# EAGLE design fami (EAGLE 7.7.0)
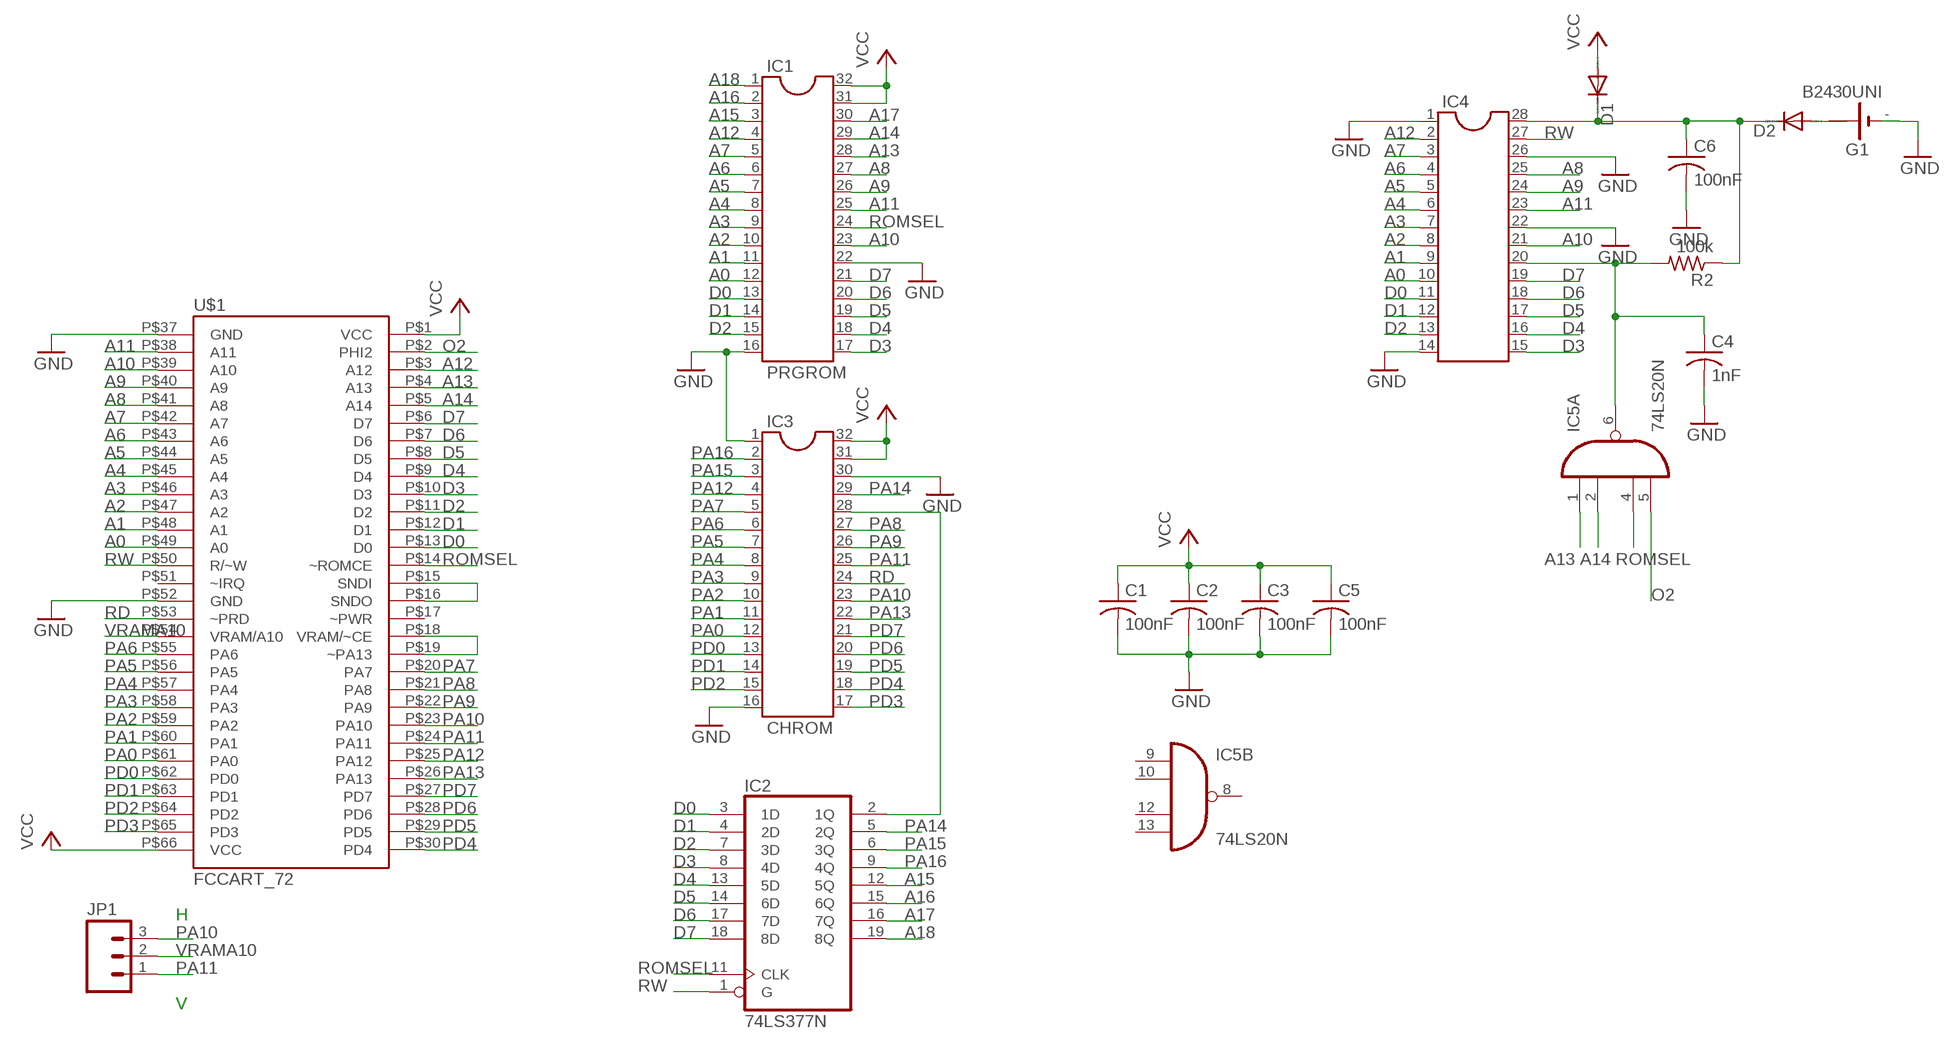
[diagram p0: schematic, sheet 1]

## Parts
C1  100nF  C-US025-025X050  [C025-025X050]
C2  100nF  C-US025-025X050  [C025-025X050]
C3  100nF  C-US025-025X050  [C025-025X050]
C4  1nF  C-US025-025X050  [C025-025X050]
C5  100nF  C-US025-025X050  [C025-025X050]
C6  100nF  C-US025-025X050  [C025-025X050]
D1  DIODE-D-5  [D-5]
D2  DIODE-D-5  [D-5]
G1  B2430UNI  [B2430UNI]
IC1  PRGROM  DIL32  [DIL32]
IC2  74LS377N  [DIL20]
IC3  CHROM  DIL32  [DIL32]
IC4  DIL28  [DIL28-6]
IC5  74LS20N  [DIL14]
JP1  M03PTH  [1X03]
R2  100k  R-US_0204/7  [0204/7]
U$1  FCCART_72  [FCCART_72]

## Nets
A0: IC1.12 IC4.10 U$1.P$49(A0)
A1: IC1.11 IC4.9 U$1.P$48(A1)
A2: IC1.10 IC4.8 U$1.P$47(A2)
A3: IC1.9 IC4.7 U$1.P$46(A3)
A4: IC1.8 IC4.6 U$1.P$45(A4)
A5: IC1.7 IC4.5 U$1.P$44(A5)
A6: IC1.6 IC4.4 U$1.P$43(A6)
A7: IC1.5 IC4.3 U$1.P$42(A7)
A8: IC1.27 IC4.25 U$1.P$41(A8)
A9: IC1.26 IC4.24 U$1.P$40(A9)
A10: IC1.23 IC4.21 U$1.P$39(A10)
A11: IC1.25 IC4.23 U$1.P$38(A11)
A12: IC1.4 IC4.2 U$1.P$3(A12)
A13: IC1.28 IC5.1(A:I0) U$1.P$4(A13)
A14: IC1.29 IC5.2(A:I1) U$1.P$5(A14)
A15: IC1.3 IC2.12(5Q)
A16: IC1.2 IC2.15(6Q)
A17: IC1.30 IC2.16(7Q)
A18: IC1.1 IC2.19(8Q)
D0: IC1.13 IC2.3(1D) IC4.11 U$1.P$13(D0)
D1: IC1.14 IC2.4(2D) IC4.12 U$1.P$12(D1)
D2: IC1.15 IC2.7(3D) IC4.13 U$1.P$11(D2)
D3: IC1.17 IC2.8(4D) IC4.15 U$1.P$10(D3)
D4: IC1.18 IC2.13(5D) IC4.16 U$1.P$9(D4)
D5: IC1.19 IC2.14(6D) IC4.17 U$1.P$8(D5)
D6: IC1.20 IC2.17(7D) IC4.18 U$1.P$7(D6)
D7: IC1.21 IC2.18(8D) IC4.19 U$1.P$6(D7)
GND: C1.2 C2.2 C3.2 C4.2 C5.2 C6.2 G1.- G1.-@1(-) IC1.16 IC1.22 IC3.1 IC3.16 IC3.30 IC4.1 IC4.14 IC4.22 IC4.26 U$1.P$37(GND) U$1.P$52(GND)
N$1: IC2.2(1Q) IC3.28
N$2: U$1.P$15(SNDI) U$1.P$16(SNDO)
N$3: U$1.P$18(VRAM/~CE) U$1.P$19(~PA13)
N$6: C6.1 D1.C D2.C IC4.28 R2.1
N$7: C4.1 IC4.20 IC5.6(A:O) R2.2
N$9: D2.A G1.+@4(+)
O2: IC5.5(A:I3) U$1.P$2(PHI2)
PA0: IC3.12 U$1.P$61(PA0)
PA1: IC3.11 U$1.P$60(PA1)
PA2: IC3.10 U$1.P$59(PA2)
PA3: IC3.9 U$1.P$58(PA3)
PA4: IC3.8 U$1.P$57(PA4)
PA5: IC3.7 U$1.P$56(PA5)
PA6: IC3.6 U$1.P$55(PA6)
PA7: IC3.5 U$1.P$20(PA7)
PA8: IC3.27 U$1.P$21(PA8)
PA9: IC3.26 U$1.P$22(PA9)
PA10: IC3.23 JP1.3 U$1.P$23(PA10)
PA11: IC3.25 JP1.1 U$1.P$24(PA11)
PA12: IC3.4 U$1.P$25(PA12)
PA13: IC3.22 U$1.P$26(PA13)
PA14: IC2.5(2Q) IC3.29
PA15: IC2.6(3Q) IC3.3
PA16: IC2.9(4Q) IC3.2
PD0: IC3.13 U$1.P$62(PD0)
PD1: IC3.14 U$1.P$63(PD1)
PD2: IC3.15 U$1.P$64(PD2)
PD3: IC3.17 U$1.P$65(PD3)
PD4: IC3.18 U$1.P$30(PD4)
PD5: IC3.19 U$1.P$29(PD5)
PD6: IC3.20 U$1.P$28(PD6)
PD7: IC3.21 U$1.P$27(PD7)
RD: IC3.24 U$1.P$53(~PRD)
ROMSEL: IC1.24 IC2.11(CLK) IC5.4(A:I2) U$1.P$14(~ROMCE)
RW: IC2.1(G) IC4.27 U$1.P$50(R/~W)
VCC: C1.1 C2.1 C3.1 C5.1 D1.A IC1.31 IC1.32 IC3.31 IC3.32 U$1.P$1(VCC) U$1.P$66(VCC)
VRAMA10: JP1.2 U$1.P$54(VRAM/A10)
Unconnected: IC5.8(B:O) IC5.9(B:I0) IC5.10(B:I1) IC5.12(B:I2) IC5.13(B:I3) U$1.P$17(~PWR) U$1.P$51(~IRQ)

## Notes on the sheet
- H
- V

## Power pins joined to a net without a drawn wire
GND: IC2.10(GND) IC5.7(P:GND)
VCC: IC2.20(VCC) IC5.14(P:VCC)

## Library data of the parts
C1-C6 = rcl:C-US: CAPACITOR, American symbol
D1 D2 = diode:DIODE-: DIODE
G1 = battery:B2430UNI: LI BATTERY
IC1 IC3 = ic-package:DIL32: Dual In Line
IC2 = 74xx-us:74*377: Octal D type FLIP FLOP, enable
IC4 = ic-package:DIL28: Dual In Line
IC5 = 74xx-eu:74*20: Dual 4-input NAND gate
JP1 = SparkFun-Connectors:M03: Header 3 Standard 3-pin 0.1" header. Use with straight break away headers (SKU : PRT-00116), right angle break away headers (PRT-00553), swiss pins (PRT-00743), machine pins (PRT-00117), and female headers (PRT-00115). Molex polarized connector foot print use with SKU : PRT-08232 with associated crimp pins and housings.
R2 = rcl:R-US_: RESISTOR, American symbol
U$1 = FC_connector_2:FCCART_72

## Board
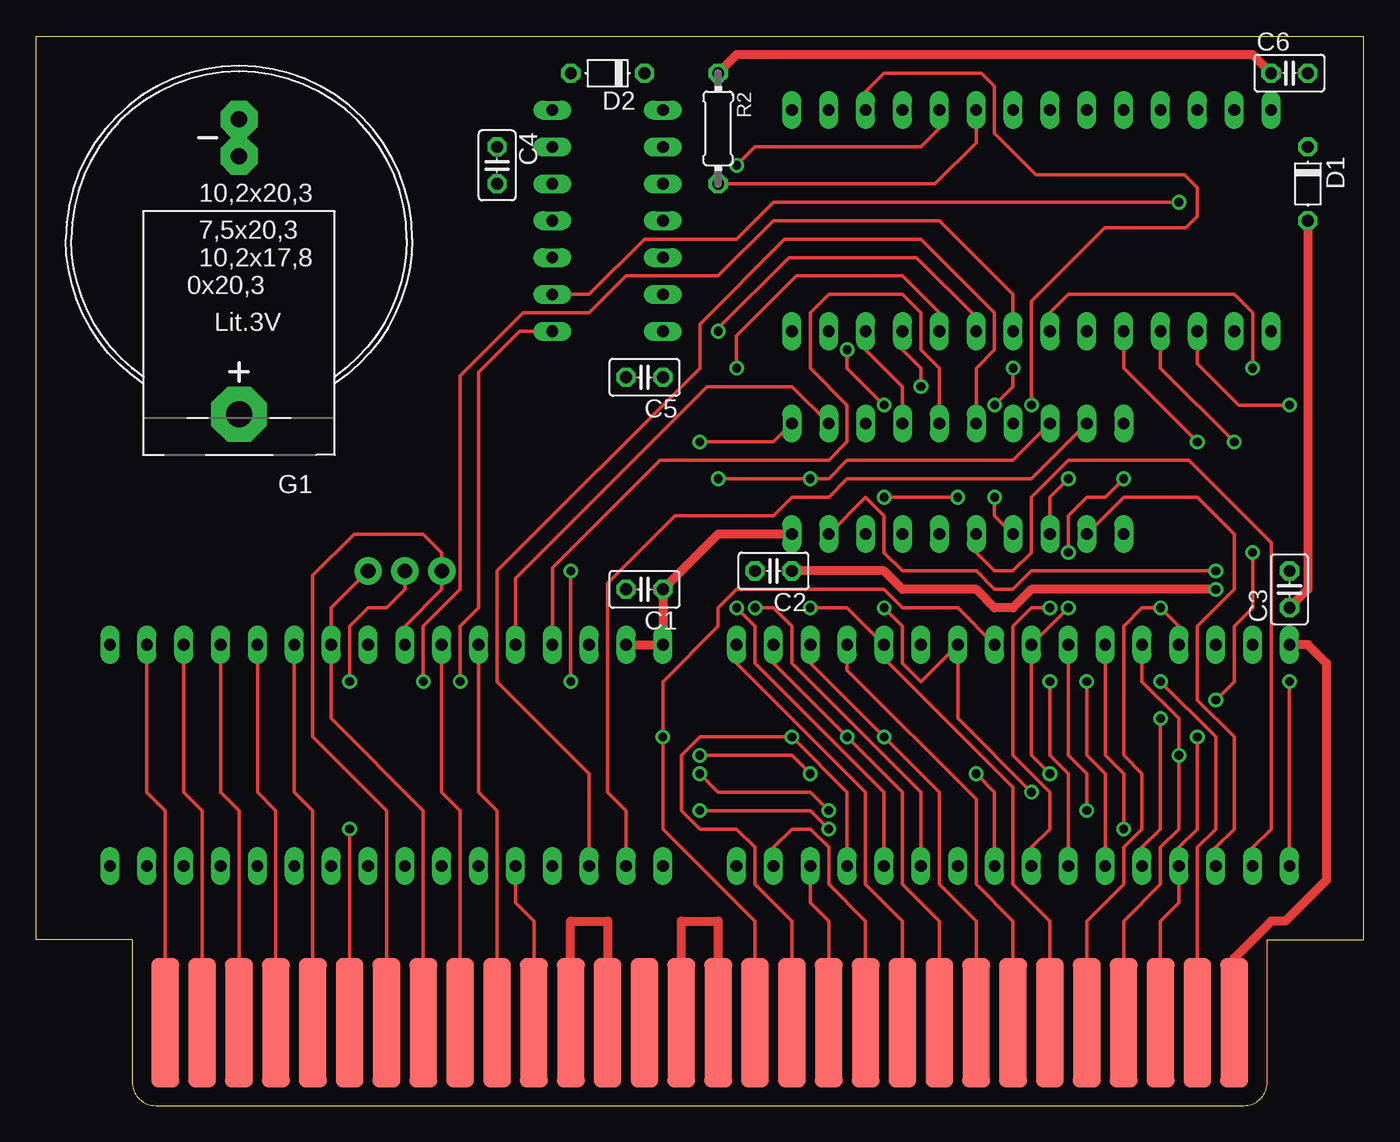
[diagram p1: board, top side]
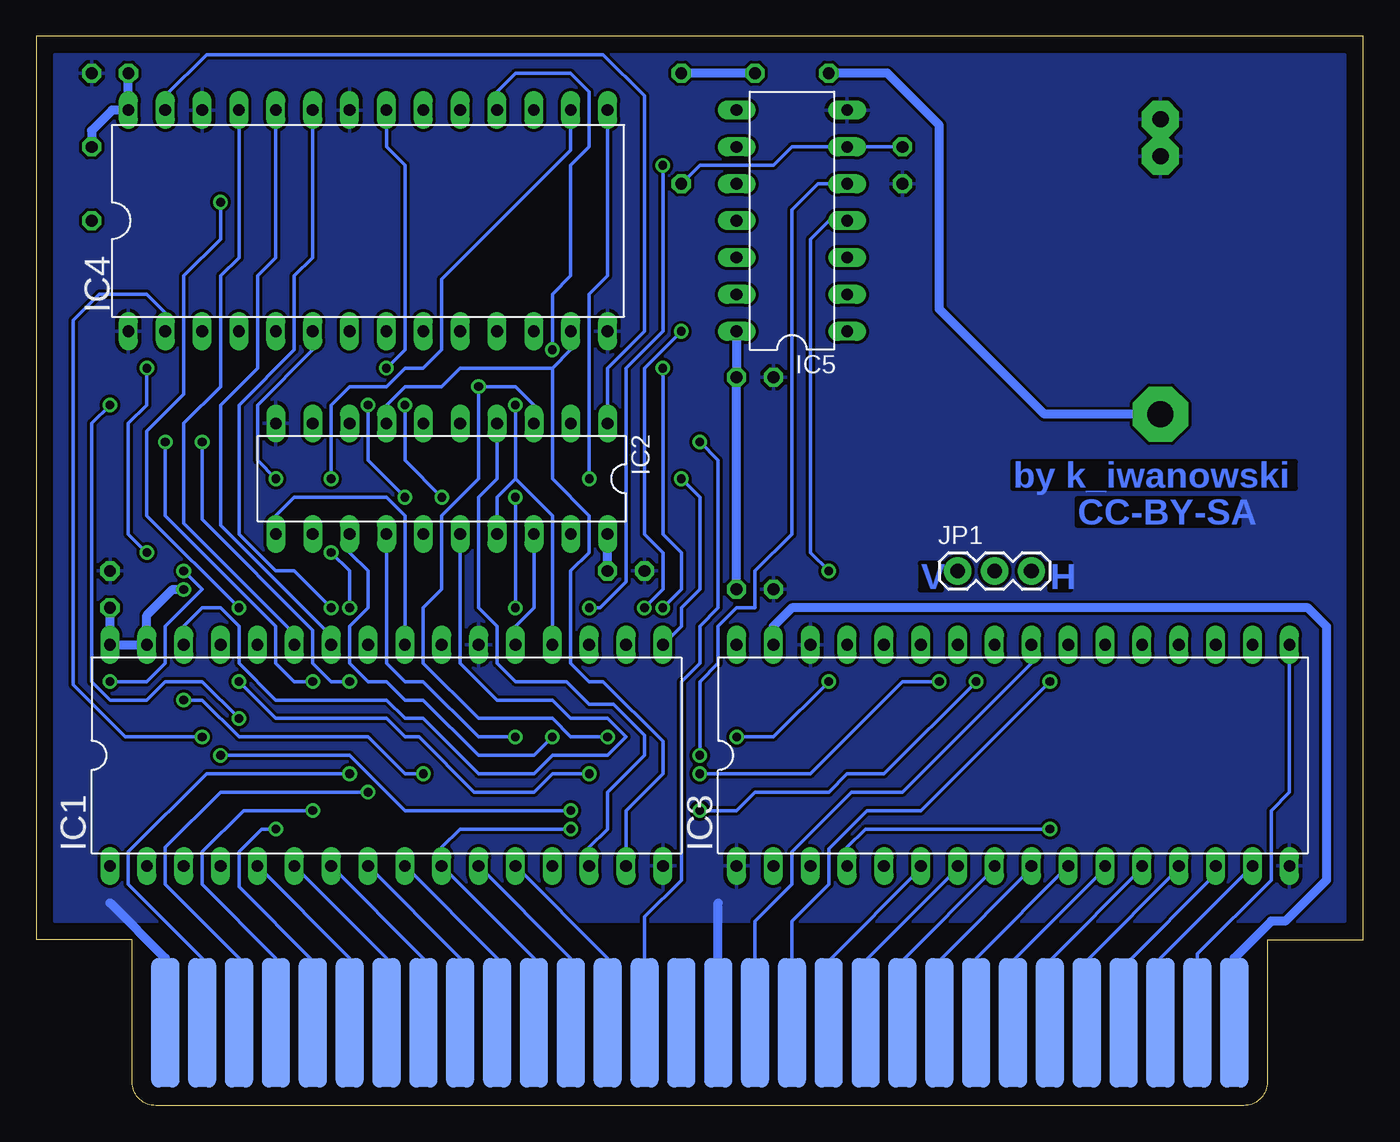
[diagram p2: board, bottom side, seen from below]

Size 91.44 x 73.66 mm. Coordinates in mm from the lower left corner, seen from the top.
Outline: 87,11.43 91.44,11.43 91.44,73.66 0,73.66 0,11.43 4.45,11.43
Copper layers (1*16): Top 0.035mm / dielectric 1.5mm / Bottom 0.035mm
Design rules "default": minimum track width 10mil, minimum drill 24mil, track to track 8mil, track to pad 8mil, pad to pad 8mil, via to via 8mil, smd to smd 8mil, copper to edge 40mil, drill to drill 8mil, minimum pad ring 10mil, minimum via ring 8mil, stop-mask expansion 4mil, vias tented up to drill 0mil, thermal gap 10mil

### Footprints (pad centres in the part's own frame; a part is rotated, then mirrored left to right if it is on the bottom)
C025-025X050 = drill 0.813 octagon: 1 -1.27,0; 2 1.27,0
D-5 = drill 0.813 octagon: A 2.54,0; C -2.54,0
B2430UNI = drill 1.803 pad 3.81 octagon: +@4 0,12.065 | drill 1.118 pad 2.54 octagon: - 0,-5.715; -@1 0,-8.255
DIL32 = drill 0.813 long: 1 -19.05,-7.62; 2 -16.51,-7.62; 3 -13.97,-7.62; 4 -11.43,-7.62; 5 -8.89,-7.62; 6 -6.35,-7.62; 7 -3.81,-7.62; 8 -1.27,-7.62; 9 1.27,-7.62; 10 3.81,-7.62; 11 6.35,-7.62; 12 8.89,-7.62; 13 11.43,-7.62; 14 13.97,-7.62; 15 16.51,-7.62; 16 19.05,-7.62; 17 19.05,7.62; 18 16.51,7.62; 19 13.97,7.62; 20 11.43,7.62; 21 8.89,7.62; 22 6.35,7.62; 23 3.81,7.62; 24 1.27,7.62; 25 -1.27,7.62; 26 -3.81,7.62; 27 -6.35,7.62; 28 -8.89,7.62; 29 -11.43,7.62; 30 -13.97,7.62; 31 -16.51,7.62; 32 -19.05,7.62
DIL20 = drill 0.813 long: 1 -11.43,-3.81; 2 -8.89,-3.81; 3 -6.35,-3.81; 4 -3.81,-3.81; 5 -1.27,-3.81; 6 1.27,-3.81; 7 3.81,-3.81; 8 6.35,-3.81; 9 8.89,-3.81; 10 11.43,-3.81; 11 11.43,3.81; 12 8.89,3.81; 13 6.35,3.81; 14 3.81,3.81; 15 1.27,3.81; 16 -1.27,3.81; 17 -3.81,3.81; 18 -6.35,3.81; 19 -8.89,3.81; 20 -11.43,3.81
DIL28-6 = drill 0.813 long: 1 -16.51,-7.62; 2 -13.97,-7.62; 3 -11.43,-7.62; 4 -8.89,-7.62; 5 -6.35,-7.62; 6 -3.81,-7.62; 7 -1.27,-7.62; 8 1.27,-7.62; 9 3.81,-7.62; 10 6.35,-7.62; 11 8.89,-7.62; 12 11.43,-7.62; 13 13.97,-7.62; 14 16.51,-7.62; 15 16.51,7.62; 16 13.97,7.62; 17 11.43,7.62; 18 8.89,7.62; 19 6.35,7.62; 20 3.81,7.62; 21 1.27,7.62; 22 -1.27,7.62; 23 -3.81,7.62; 24 -6.35,7.62; 25 -8.89,7.62; 26 -11.43,7.62; 27 -13.97,7.62; 28 -16.51,7.62
DIL14 = drill 0.813 long: 1 -7.62,-3.81; 2 -5.08,-3.81; 3 -2.54,-3.81; 4 0,-3.81; 5 2.54,-3.81; 6 5.08,-3.81; 7 7.62,-3.81; 8 7.62,3.81; 9 5.08,3.81; 10 2.54,3.81; 11 0,3.81; 12 -2.54,3.81; 13 -5.08,3.81; 14 -7.62,3.81
1X03 = drill 1.016 pad 1.88: 1 0,0; 2 2.54,0; 3 5.08,0
0204/7 = drill 0.813 octagon: 1 -3.81,0; 2 3.81,0
FCCART_72 = smd 1.905 x 8.89: P$1 -44.45,0.635; P$2 -41.91,0.635; P$3 -39.37,0.635; P$4 -36.83,0.635; P$5 -34.29,0.635; P$6 -31.75,0.635; P$7 -29.21,0.635; P$8 -26.67,0.635; P$9 -24.13,0.635; P$10 -21.59,0.635; P$11 -19.05,0.635; P$12 -16.51,0.635; P$13 -13.97,0.635; P$14 -11.43,0.635; P$15 -8.89,0.635; P$16 -6.35,0.635; P$17 -3.81,0.635; P$18 -1.27,0.635; P$19 1.27,0.635; P$20 3.81,0.635; P$21 6.35,0.635; P$22 8.89,0.635; P$23 11.43,0.635; P$24 13.97,0.635; P$25 16.51,0.635; P$26 19.05,0.635; P$27 21.59,0.635; P$28 24.13,0.635; P$29 26.67,0.635; P$30 29.21,0.635 | smd 1.905 x 8.89 bottom: P$37 -44.45,0.635; P$38 -41.91,0.635; P$39 -39.37,0.635; P$40 -36.83,0.635; P$41 -34.29,0.635; P$42 -31.75,0.635; P$43 -29.21,0.635; P$44 -26.67,0.635; P$45 -24.13,0.635; P$46 -21.59,0.635; P$47 -19.05,0.635; P$48 -16.51,0.635; P$49 -13.97,0.635; P$50 -11.43,0.635; P$51 -8.89,0.635; P$52 -6.35,0.635; P$53 -3.81,0.635; P$54 -1.27,0.635; P$55 1.27,0.635; P$56 3.81,0.635; P$57 6.35,0.635; P$58 8.89,0.635; P$59 11.43,0.635; P$60 13.97,0.635; P$61 16.51,0.635; P$62 19.05,0.635; P$63 21.59,0.635; P$64 24.13,0.635; P$65 26.67,0.635; P$66 29.21,0.635

### Placement (x,y rotation side)
C1  41.91,35.56 180 top
C2  50.8,36.83 180 top
C3  86.36,35.56 90 top
C4  31.75,64.77 270 top
C5  41.91,50.16 180 top
C6  86.36,71.12 0 top
D1  87.63,63.5 270 top
D2  39.37,71.12 180 top
G1  13.97,59.69 180 top
IC1  67.31,24.13 0 bottom
IC2  63.5,43.18 180 bottom
IC3  24.13,24.13 0 bottom
IC4  68.58,60.96 0 bottom
IC5  39.37,60.96 90 bottom
JP1  27.94,36.83 0 bottom
R2  46.99,67.31 270 top
U$1  38.1,6.35 180 top

### Tracks (layer width: path | path; a pad name or v marks a point on that pad's centre or on a via)
A0  (via drill 0.6)
  Top 0.254: IC1.12 58.42,21.59 49.53,30.48 49.53,33.02 v48.26,34.29 | IC4.10 62.23,54.61 59.69,57.15 52.37,57.15 48.26,53.04 v48.26,50.8
  Bottom 0.254: U$1.P$49 52.07,10.16 IC1.12 | v48.26,34.29 46.99,35.56 46.99,38.1 48.26,39.37 v48.26,50.8
A1  (via drill 0.6)
  Top 0.254: IC1.11 60.96,21.59 52.07,30.48 52.07,33.02 50.8,34.29 v49.53,34.29 | IC4.9 64.77,54.31 60.66,58.42 51.85,58.42 46.99,53.56 v46.99,53.34
  Bottom 0.254: U$1.P$48 54.61,10.16 IC1.11 | v49.53,34.29 48.26,35.56 48.26,38.1 49.53,39.37 49.53,50.8 v46.99,53.34
A2  (via drill 0.6)
  Top 0.254: v54.61,19.05 53.34,20.32 v45.72,20.32 | v26.67,29.21 26.67,33.02 29.21,35.56 29.21,50.27 33.55,54.61 38.1,54.61 40.64,57.15 46.99,57.15 50.8,60.96 62.23,60.96 67.31,55.88 IC4.8
  Bottom 0.254: U$1.P$47 57.15,10.16 IC1.10 63.5,17.78 62.23,19.05 v54.61,19.05 | v45.72,20.32 43.18,20.32 41.91,21.59 36.83,21.59 35.56,22.86 33.02,22.86 v26.67,29.21
A3  (via drill 0.6)
  Top 0.254: IC1.9 66.04,21.59 v64.77,22.86 | v81.28,27.94 82.55,29.21 82.55,33.02 83.82,34.29 v83.82,38.1 | v83.82,50.8 83.82,54.61 82.55,55.88 71.12,55.88 69.85,54.61 IC4.7
  Bottom 0.254: U$1.P$46 59.69,10.16 IC1.9 | v64.77,22.86 66.04,22.86 68.58,25.4 77.47,25.4 80.01,27.94 v81.28,27.94 | v83.82,38.1 85.09,39.37 85.09,46.99 83.82,48.26 v83.82,50.8
A4  (via drill 0.6)
  Top 0.254: IC1.8 68.58,17.78 69.85,19.05 69.85,21.59 67.31,24.13 67.31,33.02 68.58,34.29 v69.85,34.29 | v71.12,38.1 71.12,40.64 72.39,41.91 73.66,41.91 v74.93,43.18
  Bottom 0.254: U$1.P$45 62.23,10.16 IC1.8 | v69.85,34.29 69.85,36.83 v71.12,38.1 | v74.93,43.18 76.2,44.45 76.2,48.26 72.39,52.07 IC4.6
A5  (via drill 0.6)
  Top 0.254: IC1.7 71.12,22.86 69.85,24.13 v69.85,29.21 | v80.01,45.72 74.93,50.8 IC4.5
  Bottom 0.254: U$1.P$44 64.77,10.16 IC1.7 | v69.85,29.21 71.12,29.21 72.39,30.48 72.39,32.76 80.01,40.38 v80.01,45.72
A6  (via drill 0.6)
  Top 0.254: IC1.6 73.66,22.86 72.39,24.13 v72.39,29.21 | v82.55,45.72 77.47,50.8 IC4.4
  Bottom 0.254: U$1.P$43 67.31,10.16 IC1.6 | v72.39,29.21 73.66,29.21 74.93,30.48 74.93,33.02 82.55,40.64 v82.55,45.72
A7  (via drill 0.6)
  Top 0.254: IC1.5 76.2,17.78 77.47,19.05 v77.47,26.67 | IC4.3 80.01,51.1 82.85,48.26 v86.36,48.26
  Bottom 0.254: U$1.P$42 69.85,10.16 IC1.5 | v77.47,26.67 80.01,29.21 82.55,29.21 83.82,27.94 86.36,27.94 87.63,29.21 87.63,46.99 v86.36,48.26
A8  (via drill 0.6)
  Top 0.254: v74.93,19.05 74.93,22.86 73.66,24.13 IC1.27
  Bottom 0.254: v74.93,19.05 75.9,19.05 77.47,17.48 77.47,15.07 72.39,9.99 U$1.P$41 | IC1.27 73.66,32.49 81.28,40.11 81.28,46.99 78.74,49.53 78.74,57.15 77.47,58.42 IC4.25
A9  (via drill 0.6)
  Top 0.254: v72.39,20.32 72.39,22.86 71.12,24.13 IC1.26
  Bottom 0.254: U$1.P$40 74.93,10.16 80.01,15.24 80.01,17.47 77.16,20.32 v72.39,20.32 | IC1.26 71.12,32.35 78.74,39.97 78.74,48.26 76.2,50.8 76.2,57.15 74.93,58.42 IC4.24
A10  (via drill 0.6)
  Top 0.254: v68.58,21.59 63.5,26.67 IC1.23 60.96,29.21 59.69,30.48 59.69,33.02 v58.42,34.29 | v58.42,41.91 v63.5,41.91 | v66.04,48.26 67.31,49.53 v67.31,50.8
  Bottom 0.254: U$1.P$39 77.47,10.16 82.55,15.24 82.55,17.78 78.74,21.59 v68.58,21.59 | v58.42,34.29 v58.42,41.91 | v63.5,41.91 66.04,44.45 v66.04,48.26 | v67.31,50.8 66.04,52.07 66.04,64.77 67.31,66.04 IC4.21
A11  (via drill 0.6)
  Top 0.254: v69.85,22.86 68.58,24.13 IC1.25 v71.12,34.29
  Bottom 0.254: U$1.P$38 80.01,10.16 85.09,15.24 85.09,17.47 79.7,22.86 v69.85,22.86 | v71.12,34.29 73.66,36.83 74.93,36.83 77.47,39.37 77.47,48.26 73.66,52.07 73.66,57.15 72.39,58.42 IC4.23
A12  (via drill 0.6)
  Top 0.254: U$1.P$3 77.47,12.7 78.74,13.97 IC1.4 78.74,17.78 80.01,19.05 v80.01,25.4
  Bottom 0.254: v80.01,25.4 85.31,25.4 88.9,28.99 88.9,29.51 88.9,54.08 87.1,55.88 83.82,55.88 82.55,54.61 IC4.2
A13  (via drill 0.6)
  Top 0.254: U$1.P$4 74.93,12.7 77.47,15.24 77.47,17.78 78.74,19.05 v78.74,24.13 78.74,26.67 76.2,29.21 IC1.28 | v54.61,20.32 53.34,21.59 46.99,21.59 v45.72,22.86 | IC5.1 33.32,53.34 30.48,50.5 30.48,34.29 29.21,33.02 v29.21,29.21
  Bottom 0.254: v78.74,24.13 69.85,24.13 66.04,20.32 v54.61,20.32 | v45.72,22.86 38.1,22.86 31.75,29.21 v29.21,29.21
A14  (via drill 0.6)
  Top 0.254: U$1.P$5 72.39,12.7 74.93,15.24 74.93,17.78 76.2,19.05 76.2,22.86 74.93,24.13 74.93,33.02 76.2,34.29 v77.47,34.29 78.74,33.02 IC1.29 | IC5.2 38.1,55.88 41.91,59.69 48.26,59.69 50.8,62.23 v78.74,62.23
  Bottom 0.254: v77.47,34.29 83.82,40.64 83.82,46.46 81.28,49 81.28,57.15 78.74,59.69 v78.74,62.23
A15
  Top 0.254: IC1.3 81.28,17.78 82.55,19.05 82.55,25.4 80.01,27.94 80.01,33.02 82.55,35.56 82.55,39.37 80.01,41.91 74.93,41.91 IC2.12
A16
  Top 0.254: IC1.2 83.82,17.78 85.09,19.05 85.09,38.77 79.41,44.45 71.12,44.45 68.58,41.91 68.58,38.1 67.31,36.83 66.04,36.83 64.77,38.1 IC2.15
A17
  Bottom 0.254: IC1.30 81.28,33.02 80.01,34.29 78.74,34.29 77.47,33.02 77.47,30.48 74.93,27.94 67.31,27.94 66.04,26.67 64.77,26.67 60.96,22.86 57.15,22.86 55.88,24.13 52.07,24.13 50.8,25.4 52.07,26.67 54.61,26.67 55.88,27.94 59.69,27.94 62.23,30.48 IC2.16
A18  (via drill 0.6)
  Top 0.254: v81.28,36.83 68.58,36.83 67.31,35.56 66.04,35.56 64.77,36.83 59.69,36.83 58.42,38.1 58.42,40.64 57.15,41.91 IC2.19 | IC1.1 v86.36,29.21
  Bottom 0.254: v86.36,29.21 83.82,29.21 82.55,30.48 82.55,33.02 80.01,35.56 v81.28,36.83
D0  (via drill 0.6)
  Top 0.254: U$1.P$13 52.07,12.7 49.53,15.24 49.53,17.78 48.26,19.05 45.72,19.05 44.45,20.32 44.45,24.13 45.72,25.4 v52.07,25.4 55.88,21.59 IC1.13 | IC4.11 59.69,52.07 60.96,50.8 v60.96,49.53
  Bottom 0.254: IC2.3 57.15,48.26 58.42,49.53 v60.96,49.53 60.96,43.18 63.5,40.64 63.5,35.56 64.77,34.29 64.77,30.48 60.96,26.67 55.88,26.67 54.61,25.4 v52.07,25.4
D1
  Top 0.254: U$1.P$12 54.61,12.7 53.34,13.97 IC1.14 | IC4.12 57.15,52.07 59.69,49.53 IC2.4
  Bottom 0.254: IC1.14 53.34,17.78 52.07,19.05 52.07,21.59 49.53,24.13 49.53,25.52 51.65,27.64 53.34,27.64 54.91,29.21 58.42,29.21 59.69,30.48 59.69,33.02 60.96,34.29 60.96,41.91 59.69,43.18 IC2.4
D2
  Top 0.254: U$1.P$11 57.15,12.7 54.61,15.24 54.61,17.78 53.34,19.05 52.07,19.05 50.8,17.78 IC1.15
  Bottom 0.254: IC2.7 67.31,48.26 66.04,49.53 63.5,49.53 62.23,50.8 55.88,50.8 | 55.88,50.8 55.88,43.18 53.34,40.64 53.34,38.1 54.61,36.83 54.61,30.48 53.34,29.21 52.38,29.21 48.26,25.09 48.26,22.86 50.8,20.32 IC1.15 | IC4.13 54.61,52.07 55.88,50.8
D3  (via drill 0.6)
  Top 0.254: U$1.P$10 59.69,12.7 57.15,15.24 57.15,21.59 48.26,30.48 IC1.17 | v46.99,43.18 v53.34,43.18 54.61,43.18 55.88,44.45 67.31,44.45 IC2.8
  Bottom 0.254: IC1.17 46.99,33.02 46.99,34.29 45.72,35.56 45.72,41.91 v46.99,43.18 | IC4.15 52.07,57.15 53.34,55.88 v53.34,43.18
D4  (via drill 0.6)
  Top 0.254: U$1.P$9 62.23,12.7 59.69,15.24 59.69,21.59 v55.88,25.4 50.8,30.48 IC1.18 | IC2.13 69.85,41.91 v71.12,43.18
  Bottom 0.254: IC2.13 69.85,38.1 68.58,36.83 68.58,34.29 69.85,33.02 69.85,30.48 68.58,29.21 67.31,29.21 66.04,27.94 64.77,27.94 60.96,24.13 57.15,24.13 v55.88,25.4 | v71.12,43.18 71.12,48.26 69.85,49.53 67.31,49.53 66.04,50.8 64.77,50.8 63.5,52.07 63.5,56.91 54.61,65.8 IC4.16
D5  (via drill 0.6)
  Top 0.254: U$1.P$8 64.77,12.7 62.23,15.24 62.23,21.59 v58.42,25.4 53.34,30.48 IC1.19 | IC2.14 66.04,40.64 v66.04,41.91 | IC4.17 57.15,69.85 58.42,71.12 65.14,71.12 66.04,70.22 66.04,66.97 68.88,64.14 79.11,64.14 80.01,63.24 80.01,61.27 79.21,60.47 73.64,60.47 68.58,55.42 v68.58,48.26
  Bottom 0.254: IC2.14 67.31,30.48 66.04,29.21 64.77,29.21 60.96,25.4 v58.42,25.4 | v66.04,41.91 68.58,44.45 v68.58,48.26
D6  (via drill 0.6)
  Top 0.254: U$1.P$7 67.31,12.7 64.77,15.24 64.77,21.09 55.88,29.98 IC1.20 | v58.42,48.26 55.88,50.8 v55.88,52.07
  Bottom 0.254: IC1.20 55.88,40.64 58.42,43.18 | IC2.17 59.69,41.91 58.42,43.18 | IC4.18 59.69,69.85 58.42,71.12 54.61,71.12 53.34,69.85 53.34,66.04 54.61,64.77 54.61,57.15 55.88,55.88 v55.88,52.07 | 58.42,43.18 v58.42,48.26
D7  (via drill 0.6)
  Top 0.254: U$1.P$6 69.85,12.7 67.31,15.24 67.31,21.94 58.42,30.83 IC1.21 55.88,34.29 v53.34,34.29 | v48.26,64.77 49.53,66.04 60.96,66.04 62.23,67.31 IC4.19
  Bottom 0.254: IC1.21 58.42,33.02 57.15,34.29 IC2.18 | v53.34,34.29 52.6,34.29 50.8,36.09 50.8,50.8 48.26,53.34 v48.26,64.77
GND
  Bottom 0.61: U$1.P$52 44.45,13.97 | U$1.P$37 82.55,10.16 86.36,13.97
  pour Bottom: 1.27,72.39 90.17,72.39 90.17,12.7 1.27,12.7
N$1
  Top 0.254: IC2.2 52.07,49.53 46.23,49.53 33.02,36.32 IC3.28
N$2
  Top 0.61: U$1.P$16 44.45,12.7 46.99,12.7 U$1.P$15
N$3
  Top 0.61: U$1.P$19 36.83,12.7 39.37,12.7 U$1.P$18
N$6
  Top 0.61: C6.1 83.82,72.39 48.26,72.39 R2.1
  Bottom 0.61: D2.C R2.1 | D1.C 87.63,67.16 86.21,68.58 IC4.28 C6.1
N$7
  Top 0.254: R2.2 61.93,63.5 64.77,66.34 IC4.20
  Bottom 0.254: C4.1 IC5.6 39.37,66.04 40.64,64.77 45.72,64.77 R2.2
N$9
  Bottom 0.61: G1.+@4 21.97,47.62 29.21,54.87 29.21,67.53 32.8,71.12 D2.A
O2  (via drill 0.6)
  Top 0.254: U$1.P$2 80.01,17.78 81.28,19.05 81.28,25.4 v77.47,29.21 | v53.34,22.86 52.07,24.13 v45.72,24.13
  Bottom 0.254: v77.47,29.21 74.93,26.67 67.31,26.67 66.04,25.4 65.07,25.4 61.26,21.59 57.15,21.59 55.88,22.86 v53.34,22.86 | v45.72,24.13 45.72,29.21 44.45,30.48 44.45,33.02 43.18,34.29 41.91,34.29 41.91,36.83 39.37,39.37 39.37,61.7 37.57,63.5 IC5.5
PA0
  Bottom 0.254: U$1.P$61 21.59,9.99 15.24,16.34 IC3.12
PA1
  Bottom 0.254: U$1.P$60 24.13,9.99 17.78,16.34 IC3.11
PA2
  Bottom 0.254: U$1.P$59 26.67,10.16 IC3.10
PA3
  Bottom 0.254: U$1.P$58 29.21,9.99 22.86,16.34 IC3.9
PA4
  Bottom 0.254: U$1.P$57 31.75,9.99 25.4,16.34 IC3.8
PA5
  Bottom 0.254: U$1.P$56 34.29,9.99 27.94,16.34 IC3.7
PA6
  Bottom 0.254: U$1.P$55 36.83,9.99 30.48,16.34 IC3.6
PA7
  Top 0.254: U$1.P$20 34.29,12.7 33.02,13.97 IC3.5
PA8
  Top 0.254: U$1.P$21 31.75,20.32 30.48,21.59 IC3.27
PA9
  Top 0.254: U$1.P$22 29.21,20.32 27.94,21.59 IC3.26
PA10
  Top 0.254: U$1.P$23 26.67,20.32 20.32,26.67 IC3.23 20.32,34.29 JP1.3
PA11
  Top 0.254: U$1.P$24 24.13,20.32 19.05,25.4 19.05,36.53 21.89,39.37 26.67,39.37 27.94,38.1 JP1.1 27.94,35.56 25.4,33.02 IC3.25
PA12  (via drill 0.6)
  Top 0.254: U$1.P$25 v21.59,19.05
  Bottom 0.254: IC3.4 35.56,17.78 34.29,19.05 v21.59,19.05
PA13
  Top 0.254: U$1.P$26 19.05,20.32 17.78,21.59 IC3.22
PA14
  Top 0.254: IC2.5 62.23,50.8 60.96,52.07 60.96,54.61 59.69,55.88 54.61,55.88 53.34,54.61 53.34,50.8 55.88,48.26 55.88,45.72 54.61,44.45 42.97,44.45 40.64,42.12 35.56,37.05 IC3.29
PA15
  Top 0.254: IC3.3 38.1,22.86 31.75,29.21 31.75,36.83 45.72,50.8 45.72,53.84 51.57,59.69 60.96,59.69 66.04,54.61 66.04,52.07 64.77,50.8 IC2.6
PA16
  Top 0.254: IC3.2 40.64,20.32 39.37,21.59 39.37,36 44.01,40.64 50.8,40.64 52.07,41.91 54.61,41.91 55.88,43.18 68.58,43.18 IC2.9
PD0
  Bottom 0.254: U$1.P$62 19.05,9.99 12.7,16.34 IC3.13
PD1
  Bottom 0.254: U$1.P$63 16.51,9.61 10.16,15.96 IC3.14
PD2
  Bottom 0.254: U$1.P$64 13.97,10.16 IC3.15
PD3
  Bottom 0.254: U$1.P$65 11.43,10.46 6.35,15.54 6.35,20.32 5.08,21.59 IC3.17
PD4
  Top 0.254: U$1.P$30 8.89,20.32 7.62,21.59 IC3.18
PD5
  Top 0.254: U$1.P$29 11.43,20.32 10.16,21.59 IC3.19
PD6
  Top 0.254: U$1.P$28 13.97,20.32 12.7,21.59 IC3.20
PD7
  Top 0.254: U$1.P$27 16.51,20.32 15.24,21.59 IC3.21
RD
  Bottom 0.254: U$1.P$53 41.91,12.7 39.37,15.24 39.37,17.5 35.28,21.59 31.75,21.59 22.86,30.48 IC3.24
ROMSEL  (via drill 0.6)
  Top 0.254: U$1.P$14 49.53,12.7 43.18,19.05 v43.18,25.4 43.18,29.21 46.99,33.02 46.99,34.29 48.26,35.56 58.42,35.56 59.69,34.29 63.5,34.29 IC1.24 | v36.83,29.21 v36.83,36.83
  Bottom 0.254: IC2.11 74.93,40.64 73.66,41.91 67.31,41.91 66.04,40.64 IC1.24 | v43.18,25.4 40.64,25.4 v36.83,29.21 | v36.83,36.83 38.1,38.1 38.1,59.69 36.83,60.96 IC5.4
RW  (via drill 0.6)
  Top 0.254: v45.72,45.72 50.8,45.72 IC2.1
  Bottom 0.254: U$1.P$50 49.53,13 46.99,15.54 46.99,29.21 45.72,30.48 45.72,33.02 44.45,34.29 44.45,44.45 v45.72,45.72 | IC4.27 82.55,69.55 79.71,72.39 52.37,72.39 49.53,69.55 49.53,53.34 52.07,50.8 IC2.1
VCC  (via drill 0.6)
  Top 0.61: IC1.32 87.63,31.75 88.9,30.48 88.9,15.54 86.06,12.7 85.09,12.7 82.55,10.16 U$1.P$1 | IC3.31 IC3.32 C1.1 46.99,39.37 IC2.20 | v81.28,35.56 68.58,35.56 67.31,34.29 66.04,34.29 64.77,35.56 59.69,35.56 58.42,36.83 C2.1 | D1.A 87.63,35.56 C3.1
  Bottom 0.61: U$1.P$66 8.89,10.16 6.35,12.7 5.38,12.7 2.54,15.54 2.54,33.02 3.81,34.29 39.37,34.29 40.64,33.02 IC3.31 | C2.1 IC2.20 | C3.1 IC1.32 IC1.31 83.82,33.76 82.02,35.56 v81.28,35.56 | IC5.14 C5.1 C1.1
VRAMA10  (via drill 0.6)
  Top 0.254: v21.59,29.21 21.59,33.02 22.86,34.29 24.13,34.29 25.4,35.56 JP1.2
  Bottom 0.254: U$1.P$54 39.37,12.7 36.83,15.24 36.83,17.69 34.2,20.32 30.48,20.32 v21.59,29.21

### Text on the board
Bottom: by k_iwanowski | CC-BY-SA | H | V